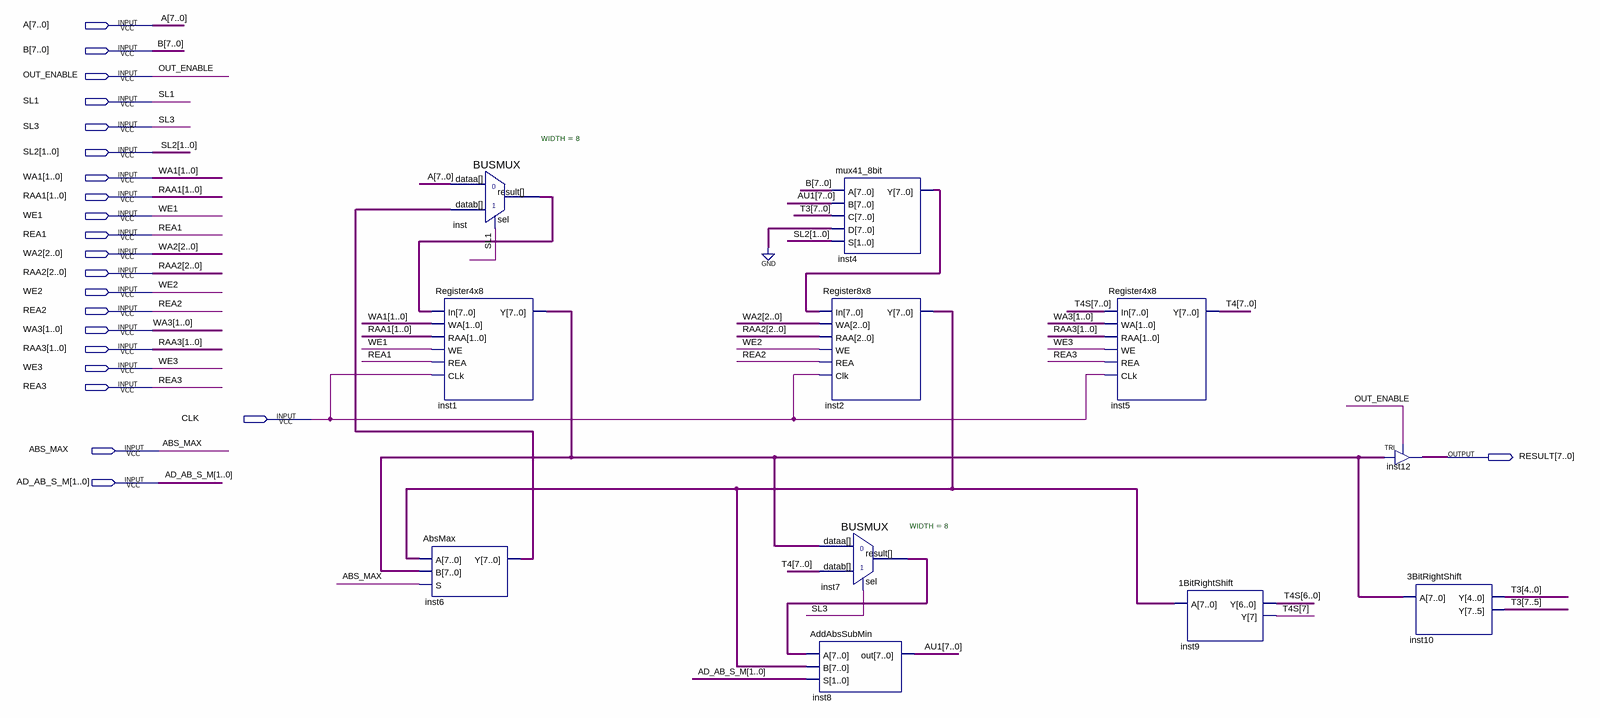
[diagram p0: schematic sheet]
// Quartus schematic DATAPATH.bdf as structural Verilog: 11 symbols, 22 pins
module DATAPATH (
  input  [7:0] A,
  input  [7:0] B,
  input  OUT_ENABLE,
  input  SL1,
  input  SL3,
  input  [1:0] SL2,
  input  [1:0] WA1,
  input  [1:0] RAA1,
  input  WE1,
  input  REA1,
  input  [2:0] WA2,
  input  [2:0] RAA2,
  input  WE2,
  input  REA2,
  input  [1:0] WA3,
  input  [1:0] RAA3,
  input  WE3,
  input  REA3,
  input  CLK,
  input  ABS_MAX,
  input  [1:0] AD_AB_S_M,
  output [7:0] RESULT
);

  wire [7:0] AU1, inst1_y, inst2_y, inst4_y, inst6_y, inst7_result, inst_result, T3, T4, T4S;

  Register4x8 inst1 (.In(inst_result), .WA(WA1), .RAA(RAA1), .WE(WE1), .REA(REA1), .CLk(CLK), .Y(inst1_y));
  AbsMax inst6 (.A(inst2_y), .B(inst1_y), .S(ABS_MAX), .Y(inst6_y));
  BUSMUX #(.WIDTH(8)) inst (.datab(inst6_y), .sel(SL1), .dataa(A), .result(inst_result));
  mux41_8bit inst4 (.A(B), .B(AU1), .C(T3), .D({8{1'b0}}), .S(SL2), .Y(inst4_y));
  Register8x8 inst2 (.In(inst4_y), .WA(WA2), .RAA(RAA2), .WE(WE2), .REA(REA2), .Clk(CLK), .Y(inst2_y));
  BUSMUX #(.WIDTH(8)) inst7 (.datab(T4), .sel(SL3), .dataa(inst1_y), .result(inst7_result));
  AddAbsSubMin inst8 (.A(inst7_result), .B(inst2_y), .S(AD_AB_S_M), .out(AU1));
  Register4x8 inst5 (.In(T4S), .WA(WA3), .RAA(RAA3), .WE(WE3), .REA(REA3), .CLk(CLK), .Y(T4));
  \1BitRightShift  inst9 (.A(inst2_y), .Y(T4S));
  TRI inst12[7:0] (.IN(inst1_y), .OE(OUT_ENABLE), .OUT(RESULT));
  \3BitRightShift  inst10 (.A(inst1_y), .Y(T3));
endmodule
